# EAGLE design GB ROM Adapter (EAGLE 6.6.0)
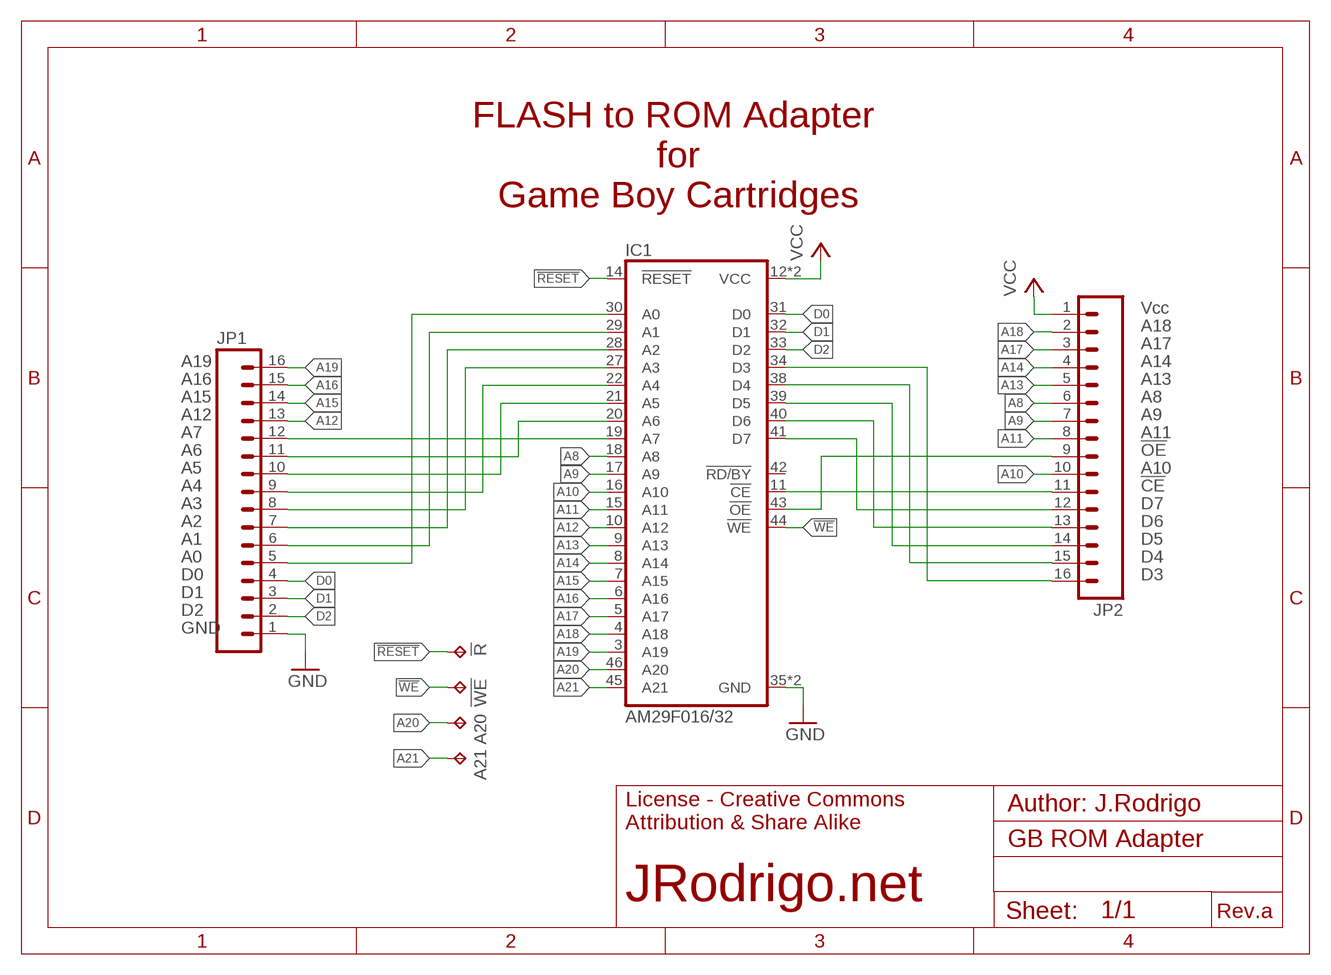
[diagram p0: schematic, sheet 1]

## Parts
!R  TPTP08SQ  [TP08SQ]
!WE  TPTP08SQ  [TP08SQ]
A20  TPTP08SQ  [TP08SQ]
A21  TPTP08SQ  [TP08SQ]
IC1  AM29F016/32  AM29FXXXTSOP48-STANDARD  [TSOP48]
JP1  CASTELLATIONS_16-PINS*  [CASTELLATIONS_16-PINS]
JP2  CASTELLATIONS_16-PINS*  [CASTELLATIONS_16-PINS]

## Nets
!RESET: !R.TP IC1.14(!RESET)
!WE: !WE.TP IC1.44(!WE)
A8: IC1.18(A8) JP2.6
A9: IC1.17(A9) JP2.7
A10: IC1.16(A10) JP2.10
A11: IC1.15(A11) JP2.8
A12: IC1.10(A12) JP1.13
A13: IC1.9(A13) JP2.5
A14: IC1.8(A14) JP2.4
A15: IC1.7(A15) JP1.14
A16: IC1.6(A16) JP1.15
A17: IC1.5(A17) JP2.3
A18: IC1.4(A18) JP2.2
A19: IC1.3(A19) JP1.16
A20: A20.TP IC1.46(A20)
A21: A21.TP IC1.45(A21)
D0: IC1.31(D0) JP1.4
D1: IC1.32(D1) JP1.3
D2: IC1.33(D2) JP1.2
GND: IC1.35(GND) IC1.36(GND) JP1.1
N$1: IC1.34(D3) JP2.16
N$2: IC1.38(D4) JP2.15
N$3: IC1.39(D5) JP2.14
N$4: IC1.40(D6) JP2.13
N$5: IC1.41(D7) JP2.12
N$6: IC1.11(!CE) JP2.11
N$7: IC1.43(!OE) JP2.9
N$8: IC1.29(A1) JP1.6
N$9: IC1.28(A2) JP1.7
N$10: IC1.30(A0) JP1.5
N$11: IC1.27(A3) JP1.8
N$12: IC1.22(A4) JP1.9
N$13: IC1.21(A5) JP1.10
N$14: IC1.20(A6) JP1.11
N$15: IC1.19(A7) JP1.12
VCC: IC1.12(VCC) IC1.37(VCC) JP2.1
Unconnected: IC1.42(!RD/BY)

## Notes on the sheet
- FLASH to ROM Adapter 
  for
  Game Boy Cartridges
- Vcc
- A18
- A17
- A19 | A14
- A16 | A13
- A15 | A8
- A12 | A9
- A7 | A11
- A6 | !OE
- A5 | A10
- A4 | !CE
- A3 | D7
- A2 | D6
- A1 | D5
- A0 | D4
- D0 | D3
- D1
- D2
- GND
- Author: J.Rodrigo
- License - Creative Commons
  Attribution & Share Alike
- JRodrigo.net
- Rev.a

## Library data of the parts
!R !WE A20 A21 = testpad:TP: Test pad
IC1 = jrodrigo-gameboy:AM29FXXX: FLASH MEMORY
JP1 JP2 = jrodrigo-gameboy:CASTELLATIONS_16-PINS: 1x16 .1" header

## Board
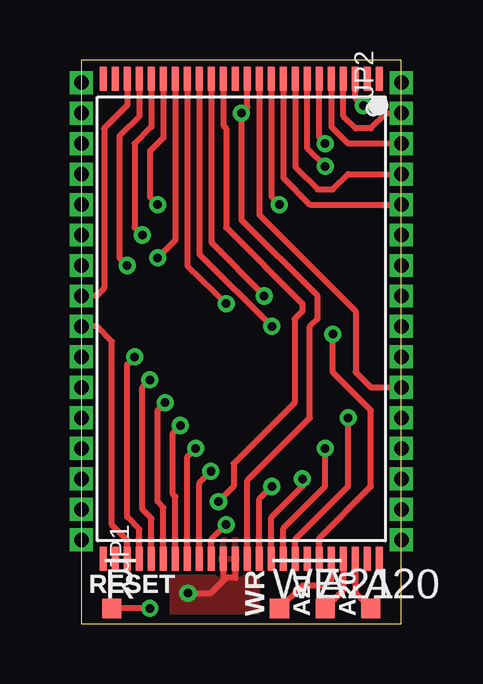
[diagram p1: board, top side]
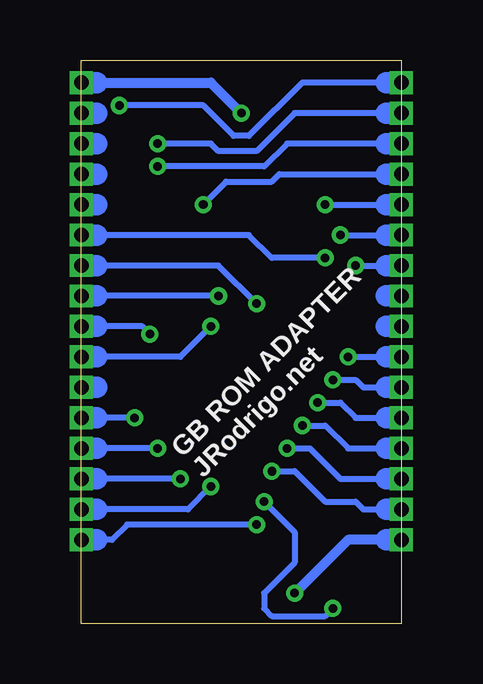
[diagram p2: board, bottom side, seen from below]

Size 13.34 x 23.48 mm. Coordinates in mm from the lower left corner, seen from the top.
Outline: 0,0 13.34,0 13.34,23.48 0,23.48 0,0
Copper layers (1*16): Top 0.0356mm / dielectric 1.5011mm / Bottom 0.0356mm
Design rules "oshpark-2layer *": minimum track width 6mil, minimum drill 13mil, track to track 6mil, track to pad 6mil, pad to pad 6mil, via to via 6mil, smd to smd 6mil, copper to edge 15mil, drill to drill 6mil, minimum pad ring 7mil, minimum via ring 7mil, stop-mask expansion 2.5mil, vias tented up to drill 20mil, thermal gap 10mil

### Footprints (pad centres in the part's own frame; a part is rotated, then mirrored left to right if it is on the bottom)
TP08SQ = smd 0.8 x 0.8: TP 0,0
TSOP48 = smd 1 x 0.3: 1 -10,5.75; 2 -10,5.25; 3 -10,4.75; 4 -10,4.25; 5 -10,3.75; 6 -10,3.25; 7 -10,2.75; 8 -10,2.25; 9 -10,1.75; 10 -10,1.25; 11 -10,0.75; 12 -10,0.25; 13 -10,-0.25; 14 -10,-0.75; 15 -10,-1.25; 16 -10,-1.75; 17 -10,-2.25; 18 -10,-2.75; 19 -10,-3.25; 20 -10,-3.75; 21 -10,-4.25; 22 -10,-4.75; 23 -10,-5.25; 24 -10,-5.75; 25 10,-5.75; 26 10,-5.25; 27 10,-4.75; 28 10,-4.25; 29 10,-3.75; 30 10,-3.25; 31 10,-2.75; 32 10,-2.25; 33 10,-1.75; 34 10,-1.25; 35 10,-0.75; 36 10,-0.25; 37 10,0.25; 38 10,0.75; 39 10,1.25; 40 10,1.75; 41 10,2.25; 42 10,2.75; 43 10,3.25; 44 10,3.75; 45 10,4.25; 46 10,4.75; 47 10,5.25; 48 10,5.75
CASTELLATIONS_16-PINS = drill 0.6 pad 0.889 square: 1 0,0; 2 1.27,0; 3 2.54,0; 4 3.81,0; 5 5.08,0; 6 6.35,0; 7 7.62,0; 8 8.89,0; 9 10.16,0; 10 11.43,0; 11 12.7,0; 12 13.97,0; 13 15.24,0; 14 16.51,0; 15 17.78,0; 16 19.05,0

### Placement (x,y rotation side)
!R  [TP08SQ]  1.27,0.64 0 top
!WE  8.26,0.64 0 top
A20  12.06,0.64 0 top
A21  10.16,0.64 0 top
IC1  6.67,12.7 270 top
JP1  0,3.49 90 top
JP2  13.34,22.54 270 top

### Tracks (layer width: path | path; a pad name or v marks a point on that pad's centre or on a via)
!RESET  (via drill 0.36)
  Top 0.254: IC1.14 5.92,20.75 6.03,20.64 6.03,16.51 9.21,13.34 9.21,13.02 8.89,12.7 8.89,9.21 6.35,6.67 6.35,5.71 v5.71,5.08 | v2.86,0.64 !R.TP
  Bottom 0.254: v5.71,5.08 4.45,3.81 4.45,2.54 5.71,1.27 5.71,0.64 5.4,0.32 3.17,0.32 v2.86,0.64
!WE
  Top 0.254: IC1.44 10.42,1.84 10.16,1.59 9.21,1.59 !WE.TP
A8  (via drill 0.36)
  Top 0.254: IC1.18 3.92,15.98 v3.17,15.24
  Bottom 0.254: v3.17,15.24 5.4,15.24 6.35,16.19 JP2.6
A9  (via drill 0.36)
  Top 0.254: IC1.17 4.42,14.89 v6.03,13.34
  Bottom 0.254: v6.03,13.34 7.62,14.92 JP2.7
A10  (via drill 0.36)
  Top 0.254: IC1.16 4.92,15.4 v7.94,12.38
  Bottom 0.254: v7.94,12.38 9.21,11.11 JP2.10
A11  (via drill 0.36)
  Top 0.254: IC1.15 5.42,15.89 v7.62,13.65
  Bottom 0.254: v7.62,13.65 JP2.8
A12  (via drill 0.36)
  Top 0.254: IC1.10 7.92,17.8 v8.26,17.46
  Bottom 0.254: v8.26,17.46 7.3,18.41 5.4,18.41 5.08,18.73 JP1.13
A13
  Top 0.254: IC1.9 8.42,18.57 9.53,17.46 JP2.5
A14
  Top 0.254: IC1.8 8.92,19.02 9.84,18.1 10.48,18.1 11.11,18.73 JP2.4
A15  (via drill 0.36)
  Top 0.254: v10.16,19.05 9.42,19.79 IC1.7
  Bottom 0.254: 0.64,20 4.76,20 5.71,19.05 v10.16,19.05
A16  (via drill 0.36)
  Top 0.254: v10.16,20 9.92,20.25 IC1.6
  Bottom 0.254: 0.64,21.27 4.45,21.27 6.03,19.68 7.62,19.68 7.94,20 v10.16,20
A17
  Top 0.254: IC1.5 10.42,20.7 11.11,20 JP2.3
A18
  Top 0.254: JP2.2 12.7,21.27 12.06,20.64 11.43,20.64 10.92,21.15 IC1.4
A19  (via drill 0.36)
  Top 0.254: v11.75,21.59 11.42,21.89 IC1.3
  Bottom 0.254: 0.64,22.54 4.13,22.54 6.35,20.32 6.99,20.32 8.26,21.59 v11.75,21.59
A20
  Top 0.254: IC1.46 11.42,1.28 A20.TP
A21
  Top 0.254: IC1.45 10.92,1.39 A21.TP
D0  (via drill 0.36)
  Top 0.254: IC1.31 3.92,5.29 3.81,5.4 3.81,7.94 v4.13,8.26
  Bottom 0.254: v4.13,8.26 3.17,8.26 2.22,7.3 JP1.4
D1  (via drill 0.36)
  Top 0.254: IC1.32 4.42,6.96 v4.76,7.3
  Bottom 0.254: v4.76,7.3 3.81,7.3 2.54,6.03 JP1.3
D2  (via drill 0.36)
  Top 0.254: IC1.33 4.92,5.87 v5.4,6.35
  Bottom 0.254: v5.4,6.35 4.45,6.35 3.17,5.08 1.91,5.08 1.59,4.76 JP1.2
GND  (via drill 0.36)
  Top 0.254: IC1.36 6.42,1.91 6.03,1.91 | IC1.35 5.92,1.91 6.03,1.91 | v4.45,1.27 5.4,1.27 6.03,1.91
  Bottom 0.406: 0.64,3.49 2.22,3.49 v4.45,1.27
  pour Top: 5.71,3.49 7.3,3.49 7.3,0.32 3.81,0.32 3.81,3.81 5.4,3.81
N$1  (via drill 0.36)
  Top 0.254: IC1.34 5.42,3.51 v6.03,4.13
  Bottom 0.254: v6.03,4.13 11.43,4.13 12.06,3.49 JP2.16
N$2  (via drill 0.36)
  Top 0.254: IC1.38 7.42,5.2 v7.94,5.71
  Bottom 0.254: v7.94,5.71 8.89,4.76 JP2.15
N$3  (via drill 0.36)
  Top 0.254: IC1.39 7.92,4.42 9.21,5.71 v9.21,6.03
  Bottom 0.254: v9.21,6.03 JP2.14
N$4  (via drill 0.36)
  Top 0.254: IC1.40 8.42,3.97 10.16,5.71 v10.16,7.3
  Bottom 0.254: v10.16,7.3 JP2.13
N$5  (via drill 0.36)
  Top 0.254: IC1.41 8.92,3.52 11.11,5.71 v11.11,8.57
  Bottom 0.254: v11.11,8.57 JP2.12
N$6
  Top 0.254: IC1.11 7.42,17.03 11.43,13.02 11.43,10.48 12.06,9.84 JP2.11
N$7  (via drill 0.36)
  Top 0.254: IC1.43 9.92,3.57 12.06,5.71 12.06,8.89 10.48,10.48 v10.48,12.06
  Bottom 0.254: v10.48,12.06 10.79,12.38 JP2.9
N$8  (via drill 0.36)
  Top 0.254: IC1.29 2.92,4.38 2.54,4.76 2.54,9.84 v2.86,10.16
  Bottom 0.254: v2.86,10.16 1.91,10.16 1.59,9.84 JP1.6
N$9  (via drill 0.36)
  Top 0.254: IC1.28 2.42,3.93 1.91,4.45 1.91,10.79 v2.22,11.11
  Bottom 0.254: v2.22,11.11 JP1.7
N$10  (via drill 0.36)
  Top 0.254: IC1.30 3.42,4.84 3.17,5.08 3.17,8.89 v3.49,9.21
  Bottom 0.254: v3.49,9.21 2.54,9.21 1.91,8.57 JP1.5
N$11
  Top 0.254: IC1.27 1.92,3.48 1.27,4.13 1.27,11.75 0.64,12.38 JP1.8
N$12
  Top 0.254: IC1.22 1.92,21.6 0.95,20.64 0.95,13.97 0.64,13.65 JP1.9
N$13  (via drill 0.36)
  Top 0.254: IC1.21 2.42,21.15 1.59,20.32 1.59,15.24 v1.91,14.92
  Bottom 0.254: v1.91,14.92 JP1.10
N$14  (via drill 0.36)
  Top 0.254: IC1.20 2.92,20.7 2.22,20 2.22,16.51 v2.54,16.19
  Bottom 0.254: v2.54,16.19 JP1.11
N$15  (via drill 0.36)
  Top 0.254: IC1.19 3.42,20.25 2.86,19.68 2.86,17.78 v3.17,17.46
  Bottom 0.254: v3.17,17.46 JP1.12
VCC  (via drill 0.36)
  Top 0.254: IC1.12 6.92,21.52 v6.67,21.27 6.67,16.83 9.84,13.65 9.84,12.7 9.53,12.38 9.53,8.57 6.92,5.96 IC1.37
  Bottom 0.406: 12.7,22.54 7.94,22.54 v6.67,21.27

### Text on the board
tNames: RESET | WR | A21 | A20
bNames: GB ROM ADAPTER / JRodrigo.net
t_Silk_Screen: RESET | WR | A21 | A20
b_Silk_Screen_Text: GB ROM ADAPTER / JRodrigo.net